# EAGLE design atmegademo (EAGLE 6.5.0)
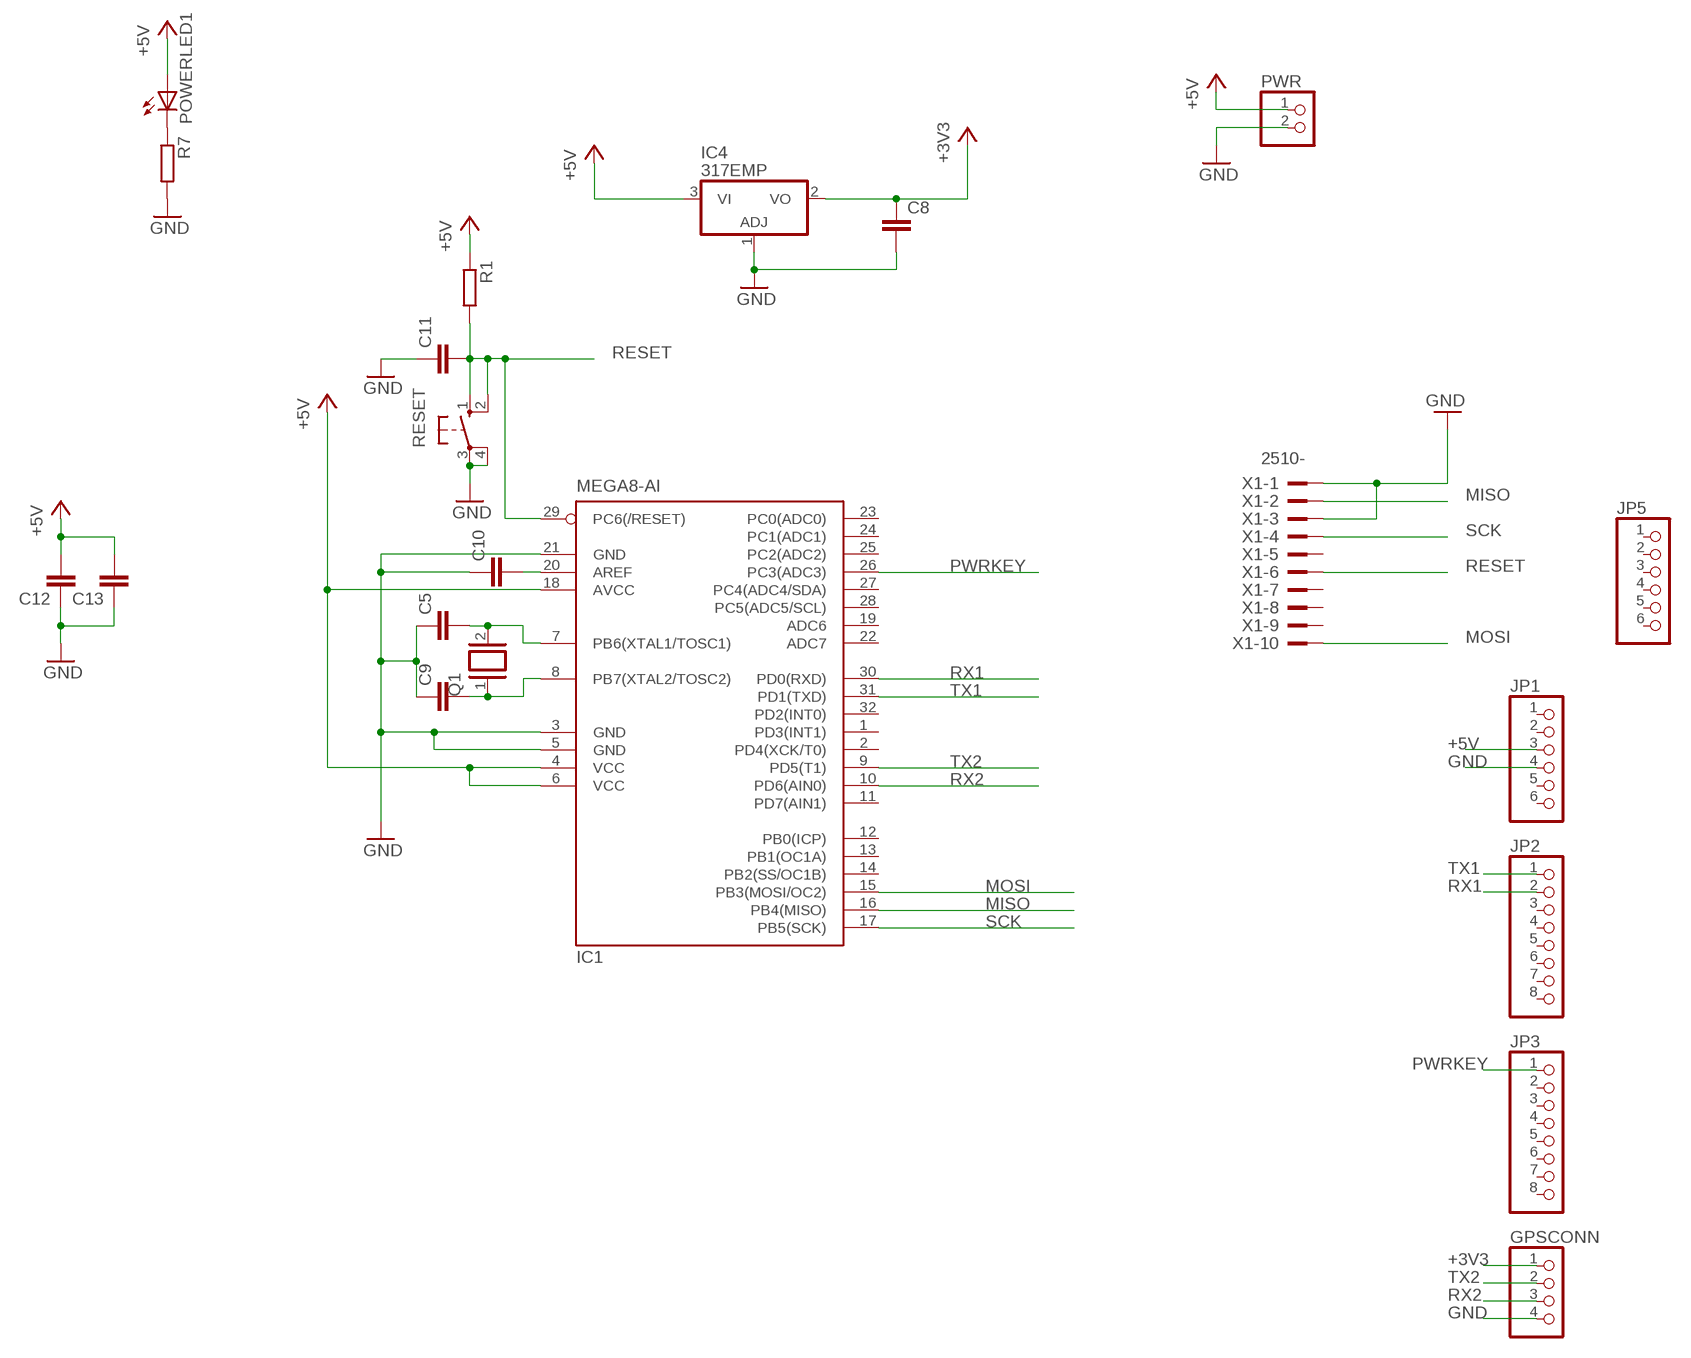
[diagram p0: schematic, sheet 1]

## Parts
C5  C-EUC0805K  [C0805K]
C8  C-EUC0805K  [C0805K]
C9  C-EUC0805K  [C0805K]
C10  C-EUC0805K  [C0805K]
C11  C-EUC0805K  [C0805K]
C12  C-EUC0805K  [C0805K]
C13  C-EUC0805K  [C0805K]
GPSCONN  PINHD-1X4  [1X04]
IC1  MEGA8-AI  [TQFP32-08]
IC4  317EMP  [SOT223]
JP1  PINHD-1X6CLEAN  [1X06-CLEAN]
JP2  PINHD-1X8CLEANBIG  [1X08-CLEANBIG]
JP3  PINHD-1X8CLEANBIG  [1X08-CLEANBIG]
JP5  PINHD-1X6CLEAN  [1X06-CLEAN]
POWERLED1  LEDCHIP-LED0805  [CHIP-LED0805]
PWR  PINHD-1X2  [1X02]
Q1  XTAL/S  [QS]
R1  R-EU_R0805  [R0805]
R7  R-EU_R0805  [R0805]
RESET  10-XX  [B3F-10XX]
X1  2510-  [PAK100/2500-10]

## Nets
+3V3: C8.1 GPSCONN.1 IC4.2(VO)
+5V: C12.2 C13.2 IC1.4(VCC) IC1.6(VCC) IC1.18(AVCC) IC4.3(VI) JP1.3 POWERLED1.A PWR.1 R1.1
GND: C5.1 C8.2 C9.1 C10.1 C11.1 C12.1 C13.1 GPSCONN.4 IC1.3(GND) IC1.5(GND) IC1.21(GND) IC4.1(ADJ) JP1.4 PWR.2 R7.2 RESET.3(P) RESET.4(P1) X1.1 X1.3
MISO: IC1.16(PB4(MISO)) X1.2
MOSI: IC1.15(PB3(MOSI/OC2)) X1.10
N$2: POWERLED1.C R7.1
N$26: C10.2 IC1.20(AREF)
N$27: C5.2 IC1.7(PB6(XTAL1/TOSC1)) Q1.2
N$30: C9.2 IC1.8(PB7(XTAL2/TOSC2)) Q1.1
PWRKEY: IC1.26(PC3(ADC3)) JP3.1
RESET: C11.2 IC1.29(PC6(/RESET)) R1.2 RESET.1(S) RESET.2(S1) X1.6
RX1: IC1.30(PD0(RXD)) JP2.2
RX2: GPSCONN.3 IC1.10(PD6(AIN0))
SCK: IC1.17(PB5(SCK)) X1.4
TX1: IC1.31(PD1(TXD)) JP2.1
TX2: GPSCONN.2 IC1.9(PD5(T1))
Unconnected: IC1.1(PD3(INT1)) IC1.2(PD4(XCK/T0)) IC1.11(PD7(AIN1)) IC1.12(PB0(ICP)) IC1.13(PB1(OC1A)) IC1.14(PB2(SS/OC1B)) IC1.19(ADC6) IC1.22(ADC7) IC1.23(PC0(ADC0)) IC1.24(PC1(ADC1)) IC1.25(PC2(ADC2)) IC1.27(PC4(ADC4/SDA)) IC1.28(PC5(ADC5/SCL)) IC1.32(PD2(INT0)) JP1.1 JP1.2 JP1.5 JP1.6 JP2.3 JP2.4 JP2.5 JP2.6 JP2.7 JP2.8 JP3.2 JP3.3 JP3.4 JP3.5 JP3.6 JP3.7 JP3.8 JP5.1 JP5.2 JP5.3 JP5.4 JP5.5 JP5.6 X1.5 X1.7 X1.8 X1.9

## Library data of the parts
C5 C8-C13 = resistor:C-EU: CAPACITOR, European symbol
GPSCONN = pinhead:PINHD-1X4: PIN HEADER
IC1 = atmel:MEGA8: MICROCONTROLLER 8 Kbytes FLASH, 1 kbytes SRAM, 512 bytes EEPROM, USART, 6-channel 10 bit ADC, 2-channel 8 bit ADC Pin compatible with Atmega48, ATMega88, ATMega168 Source: avr.lbr; MPN: ATMEGA8-16AU; OC_FARNELL: 9171371; OC_NEWARK: 73M8863
IC4 = linear:*317: Positive VOLTAGE REGULATOR
JP1 JP5 = adafruit:PINHD-1X6: PIN HEADER
JP2 JP3 = adafruit:PINHD-1X8: PIN HEADER
POWERLED1 = led:LED: LED OSRAM: - CHIPLED LG R971, LG N971, LY N971, LG Q971, LY Q971, LO R971, LY R971 LH N974, LH R974 LS Q976, LO Q976, LY Q976 LO Q996 - Hyper CHIPLED LW Q18S LB Q993, LB Q99A, LB R99A - SideLED LS A670, LO A670, LY A670, LG A670, LP A670 LB A673, LV A673, LT A673, LW A673 LH A674 LY A675 LS A676, LA A676, LO A676, LY A676, LW A676 LS A679, LY A679, LG A679 - Hyper Micro SIDELED® LS Y876, LA Y876, LO Y876, LY Y876 LT Y87S - SmartLED LW L88C, LW L88S LB L89C, LB L89S, LG L890 LS L89K, LO L89K, LY L89K LS L896, LA L896, LO L896, LY L896 - TOPLED LS T670, LO T670, LY T670, LG T670, LP T670 LSG T670, LSP T670, LSY T670, LOP T670, LYG T670 LG T671, LOG T671, LSG T671 LB T673, LV T673, LT T673, LW T673 LH T674 LS T676, LA T676, LO T676, LY T676, LB T676, LH T676, LSB T676, LW T676 LB T67C, LV T67C, LT T67C, LS T67K, LO T67K, LY T67K, LW E67C LS E67B, LA E67B, LO E67B, LY E67B, LB E67C, LV E67C, LT E67C LW T67C LS T679, LY T679, LG T679 LS T770, LO T770, LY T770, LG T770, LP T770 LB T773, LV T773, LT T773, LW T773 LH T774 LS E675, LA E675, LY E675, LS T675 LS T776, LA T776, LO T776, LY T776, LB T776 LHGB T686 LT T68C, LB T68C - Hyper Mini TOPLED® LB M676 - Mini TOPLED Santana® LG M470 LS M47K, LO M47K, LY M47K Source: http://www.osram.convergy.de LUXEON: - LUMILED® LXK2-PW12-R00, LXK2-PW12-S00, LXK2-PW14-U00, LXK2-PW14-V00 LXK2-PM12-R00, LXK2-PM12-S00, LXK2-PM14-U00 LXK2-PE12-Q00, LXK2-PE12-R00, LXK2-PE12-S00, LXK2-PE14-T00, LXK2-PE14-U00 LXK2-PB12-K00, LXK2-PB12-L00, LXK2-PB12-M00, LXK2-PB14-N00, LXK2-PB14-P00, LXK2-PB14-Q00 LXK2-PR12-L00, LXK2-PR12-M00, LXK2-PR14-Q00, LXK2-PR14-R00 LXK2-PD12-Q00, LXK2-PD12-R00, LXK2-PD12-S00 LXK2-PH12-R00, LXK2-PH12-S00 LXK2-PL12-P00, LXK2-PL12-Q00, LXK2-PL12-R00 Source: www.luxeon.com KINGBRIGHT: KA-3528ASYC Source: www.kingbright.com
PWR = pinhead:PINHD-1X2: PIN HEADER
Q1 = special:XTAL/S: CRYSTAL
R1 R7 = resistor:R-EU_: RESISTOR, European symbol
RESET = switch-omron:10-XX: OMRON SWITCH; MPN: B3F-1000; OC_FARNELL: 176432; OC_NEWARK: 36M3542
X1 = con-3m:2510-: 3M (TM) Pak 100 4-Wall Header Source: 3M; MF: 3M; MPN: 2510-6002UB; OC_FARNELL: 9838244; OC_NEWARK: 46F4725

## Net classes
0 default: clearance 0.355 mm

## Board
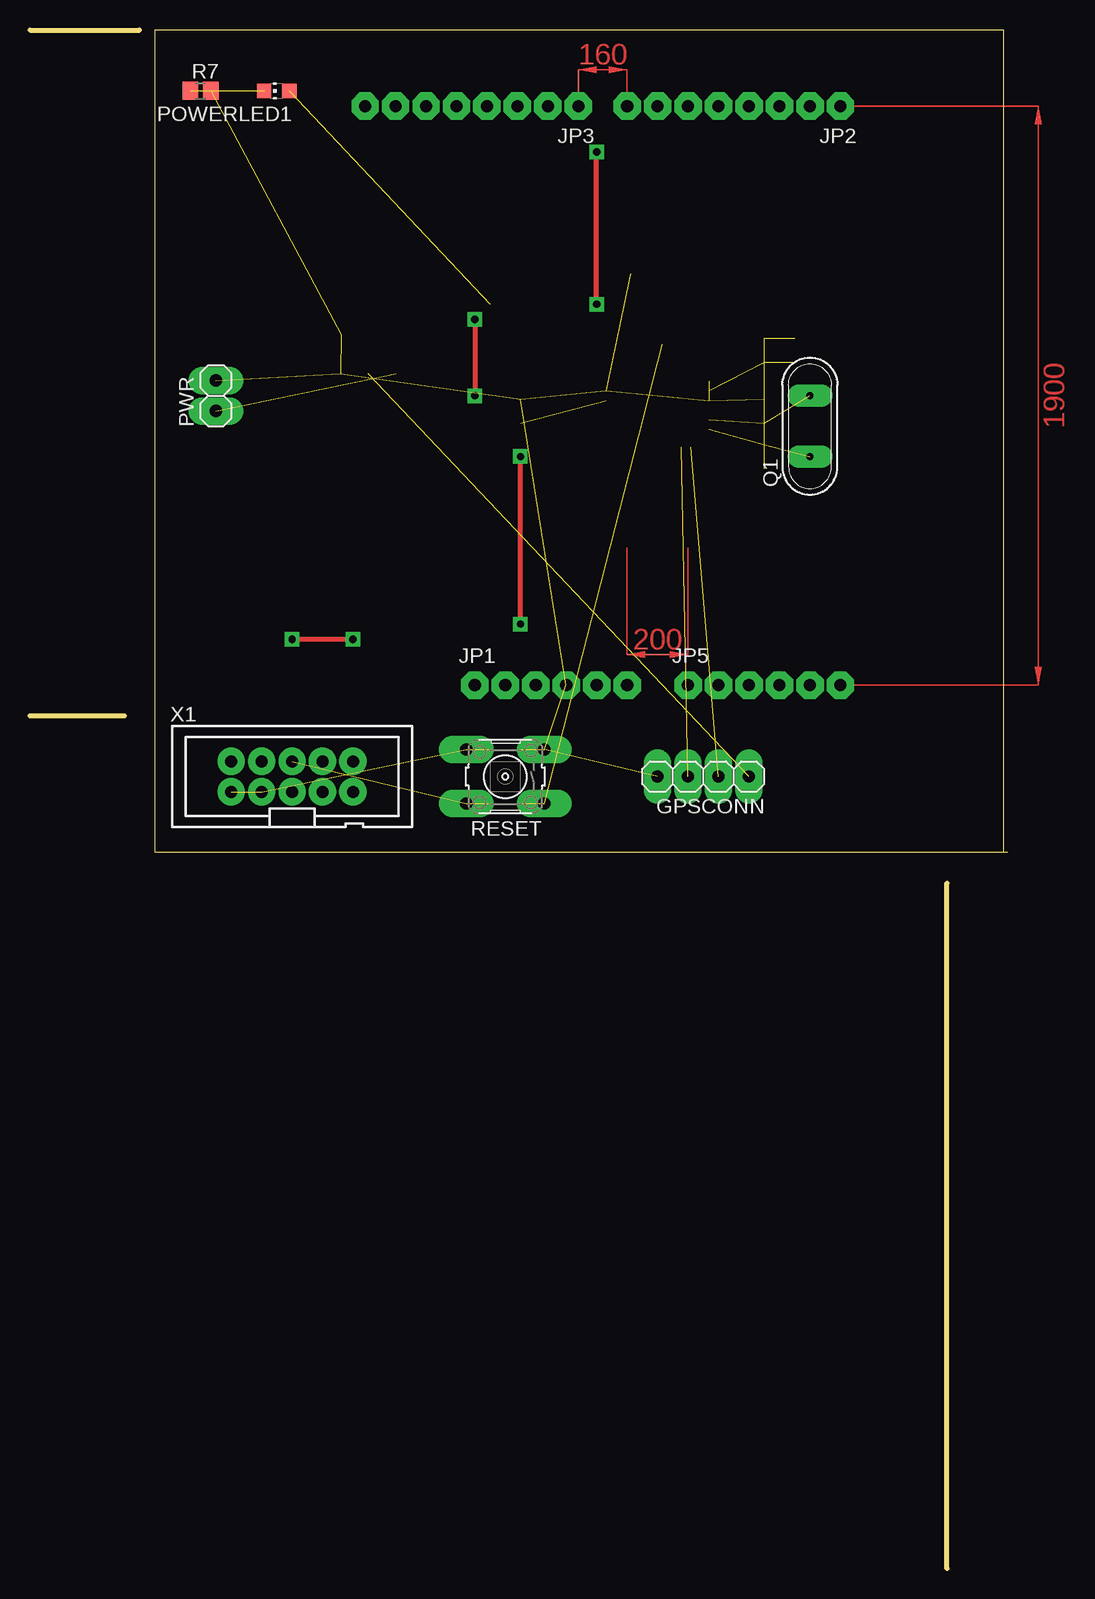
[diagram p1: board, top side]
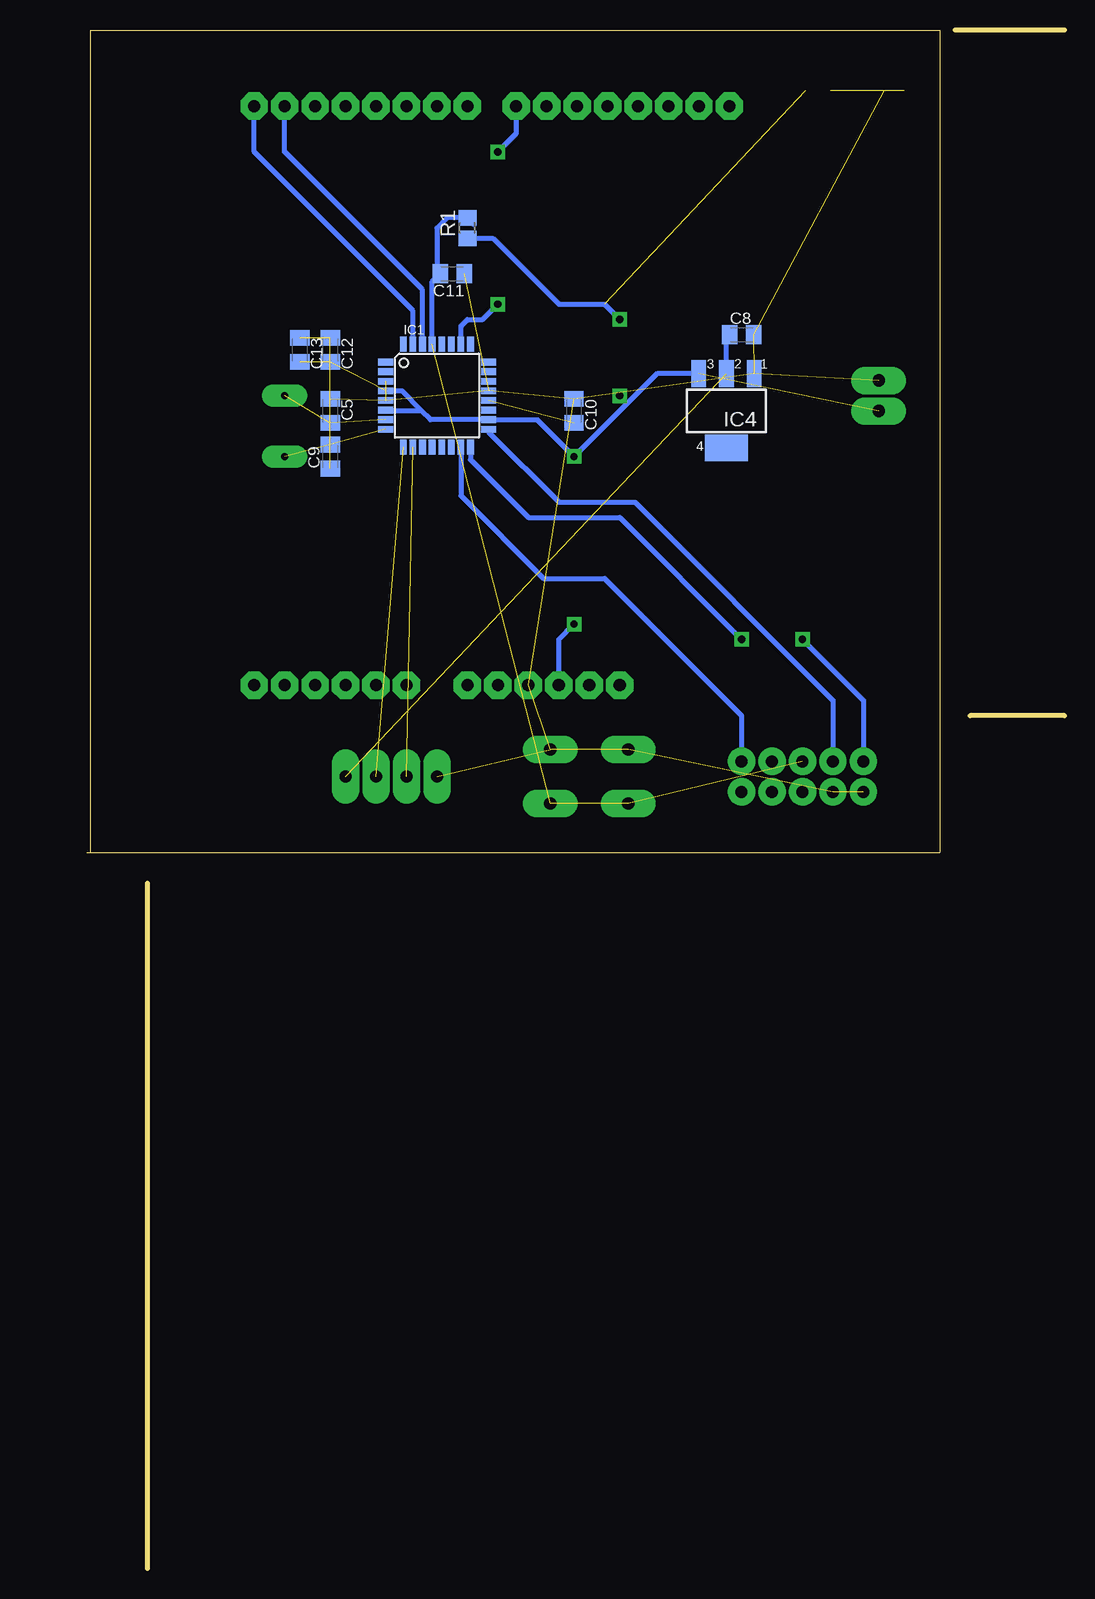
[diagram p2: board, bottom side, seen from below]

Size 81.53 x 128.27 mm. Coordinates in mm from the lower left corner, seen from the top.
Outline: 81.2,59.69 81.2,128.26 10.41,128.26 10.41,59.69 81.53,59.69
Outline: 0,128.27 9.14,128.27
Outline: 0,71.12 7.87,71.12
Outline: 76.45,0 76.45,57.15
Copper layers (1*16): Top 0.035mm / dielectric 1.5mm / Bottom 0.035mm
Design rules "default": minimum track width 10mil, minimum drill 32mil, track to track 12mil, track to pad 12mil, pad to pad 12mil, via to via 12mil, smd to smd 8mil, copper to edge 40mil, drill to drill 40mil, minimum pad ring 25mil, minimum via ring 12mil, stop-mask expansion 4mil, vias tented up to drill 0mil, thermal gap 15mil

### Footprints (pad centres in the part's own frame; a part is rotated, then mirrored left to right if it is on the bottom)
C0805K = smd 1.3 x 1.6: 1 -1,0; 2 1,0
1X04 = drill 1.016 long: 1 -3.81,0; 2 -1.27,0; 3 1.27,0; 4 3.81,0
TQFP32-08 = smd 1.27 x 0.559: 1 -4.293,2.8; 2 -4.293,2; 3 -4.293,1.2; 4 -4.293,0.4; 5 -4.293,-0.4; 6 -4.293,-1.2; 7 -4.293,-2; 8 -4.293,-2.8; 17 4.293,-2.8; 18 4.293,-2; 19 4.293,-1.2; 20 4.293,-0.4; 21 4.293,0.4; 22 4.293,1.2; 23 4.293,2; 24 4.293,2.8 | smd 0.559 x 1.27: 9 -2.8,-4.293; 10 -2,-4.293; 11 -1.2,-4.293; 12 -0.4,-4.293; 13 0.4,-4.293; 14 1.2,-4.293; 15 2,-4.293; 16 2.8,-4.293; 25 2.8,4.293; 26 2,4.293; 27 1.2,4.293; 28 0.4,4.293; 29 -0.4,4.293; 30 -1.2,4.293; 31 -2,4.293; 32 -2.8,4.293
SOT223 = smd 1.219 x 2.235: 1 -2.311,-3.099; 2 0,-3.099; 3 2.311,-3.099 | smd 3.6 x 2.2: 4 0,3.099
1X06-CLEAN = drill 1.016 octagon: 1 -6.35,0; 2 -3.81,0; 3 -1.27,0; 4 1.27,0; 5 3.81,0; 6 6.35,0
1X08-CLEANBIG = drill 1.016 pad 1.778 octagon: 1 -8.89,0; 2 -6.35,0; 3 -3.81,0; 4 -1.27,0; 5 1.27,0; 6 3.81,0; 7 6.35,0; 8 8.89,0
CHIP-LED0805 = smd 1.2 x 1.2: A 0,-1.05; C 0,1.05
1X02 = drill 1.016 long: 1 -1.27,0; 2 1.27,0
QS = drill 0.61 long: 1 -2.54,0; 2 2.54,0
R0805 = smd 1.3 x 1.5: 1 -0.85,0; 2 0.85,0
B3F-10XX = drill 1.016 long: 1 -3.251,2.261; 2 3.251,2.261; 3 -3.251,-2.261; 4 3.251,-2.261
PAK100/2500-10 = drill 1 pad 1.422: 1 -5.08,-1.27; 2 -5.08,1.27; 3 -2.54,-1.27; 4 -2.54,1.27; 5 0,-1.27; 6 0,1.27; 7 2.54,-1.27; 8 2.54,1.27; 9 5.08,-1.27; 10 5.08,1.27

### Placement (x,y rotation side)
C5  61.21,96.52 270 bottom
C8  26.92,102.87 0 bottom
C9  61.21,92.71 90 bottom
C10  40.89,96.52 270 bottom
C11  51.05,107.95 180 bottom
C12  61.21,101.6 270 bottom
C13  63.75,101.6 270 bottom
GPSCONN  56.13,66.04 180 top
IC1  52.32,97.79 0 bottom
IC4  28.19,96.52 180 bottom
JP1  43.43,73.66 0 top
JP2  58.67,121.92 180 top
JP3  36.83,121.92 180 top
JP5  61.21,73.66 0 top
POWERLED1  20.57,123.19 90 top
PWR  15.49,97.79 90 top
Q1  65.02,95.25 90 top
R1  49.78,111.76 90 bottom
R7  14.22,123.19 0 top
RESET  39.62,66.04 180 top
X1  21.84,66.04 0 top

### Tracks (layer width: path | path; a pad name or v marks a point on that pad's centre or on a via)
+3V3  (1 unrouted)
  Bottom 0.406: IC4.2 28.19,102.6 C8.1
+5V  (via drill 0.6)  (4 unrouted)
  Top 0.406: v40.89,78.74 v40.89,92.71 | v37.08,104.14 v37.08,97.79
  Bottom 0.406: 53.59,96.52 52.86,95.79 IC1.18 43.97,95.79 v40.89,92.71 36.45,97.16 | 53.59,96.52 56.55,96.52 IC1.6 | IC1.4 55.26,98.19 53.59,96.52 | JP1.3 42.16,77.47 v40.89,78.74 | IC4.3 33.98,99.62 36.45,97.16 | R1.1 47.66,110.91 42.16,105.41 38.35,105.41 v37.08,104.14 | v37.08,97.79 36.45,97.16
GND  (18 unrouted)
  cutout Bottom: 7.87,137.16 86.61,137.16 86.61,58.42 7.87,58.42
MISO  (via drill 0.6)
  Top 0.406: v26.92,77.47 v21.84,77.47
  Bottom 0.406: IC1.16 49.52,92.45 44.7,87.63 37.08,87.63 v26.92,77.47 | v21.84,77.47 16.76,72.39 X1.2
MOSI
  Bottom 0.406: IC1.15 50.32,89.44 43.43,82.55 38.35,82.55 26.92,71.12 X1.10
N$2  (1 unrouted)
N$26  (1 unrouted)
N$27  (2 unrouted)
N$30  (2 unrouted)
PWRKEY  (via drill 0.6)
  Top 0.406: v47.24,105.41 v47.24,118.11
  Bottom 0.406: IC1.26 50.32,103.6 49.78,104.14 48.51,104.14 v47.24,105.41 | v47.24,118.11 45.72,119.63 JP3.1
RESET  (3 unrouted)
  Bottom 0.406: IC1.29 52.72,107.28 C11.2 52.32,108.22 52.32,111.76 51.47,112.61 R1.2 49.21,112.04
RX1
  Bottom 0.406: IC1.30 53.52,106.61 65.02,118.11 JP2.2
RX2  (1 unrouted)
SCK
  Bottom 0.406: IC1.17 48.03,94.77 42.16,88.9 35.81,88.9 19.3,72.39 X1.4
TX1
  Bottom 0.406: IC1.31 54.32,104.87 67.56,118.11 JP2.1
TX2  (1 unrouted)
(copper drawn outside any net)
  shapes: Top area x3